# EAGLE design atxmega16d4 (EAGLE 7.3.0)
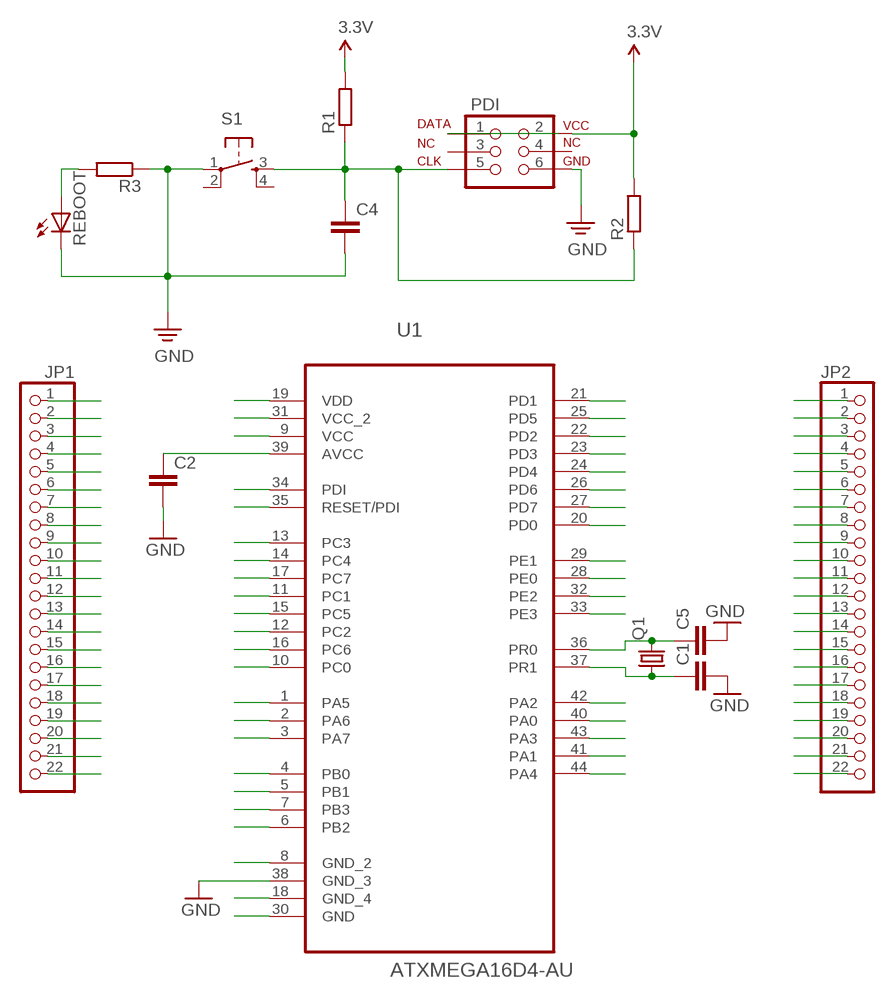
[diagram p0: schematic, sheet 1]

## Parts
C1  C-EU025-025X050  [C025-025X050]
C2  C-EU025-025X050  [C025-025X050]
C4  C-EU025-040X050  [C025-040X050]
C5  C-EU025-025X050  [C025-025X050]
JP1  PINHD-1X22  [1X22]
JP2  PINHD-1X22  [1X22]
PDI  XMEGA_PDI_PRGNS  [2X3-NS]
Q1  CRYSTALHC49U-V  [HC49U-V]
R1  R-EU_0309/10  [0309/10]
R2  R-EU_0207/10  [0207/10]
R3  R-EU_0207/10  [0207/10]
REBOOT  LED3MM  [LED3MM]
S1  TAC_SWITCHPTH  [TACTILE-PTH]
U1  ATXMEGA16D4-AU  [QFP80P1200X1200X120-44N]

## Nets
3.3V: C2.1 JP1.9 JP1.19 JP2.9 JP2.17 PDI.2 R1.2 R2.2 U1.9(VCC) U1.19(VDD) U1.31(VCC_2) U1.39(AVCC)
GND: C1.2 C2.2 C4.2 C5.2 JP1.8 JP1.18 JP2.8 JP2.16 PDI.6 R3.1 REBOOT.K(C) S1.1 U1.8(GND_2) U1.18(GND_4) U1.30(GND) U1.38(GND_3)
N$32: R3.2 REBOOT.A
PA0: JP2.18 U1.40(PA0)
PA1: JP2.19 U1.41(PA1)
PA2: JP2.20 U1.42(PA2)
PA3: JP2.21 U1.43(PA3)
PA4: JP2.22 U1.44(PA4)
PA5: JP1.1 U1.1(PA5)
PA6: JP1.2 U1.2(PA6)
PA7: JP1.3 U1.3(PA7)
PB0: JP1.4 U1.4(PB0)
PB1: JP1.5 U1.5(PB1)
PB2: JP1.6 U1.6(PB2)
PB3: JP1.7 U1.7(PB3)
PC0: JP1.10 U1.10(PC0)
PC1: JP1.11 U1.11(PC1)
PC2: JP1.12 U1.12(PC2)
PC3: JP1.13 U1.13(PC3)
PC4: JP1.14 U1.14(PC4)
PC5: JP1.15 U1.15(PC5)
PC6: JP1.16 U1.16(PC6)
PC7: JP1.17 U1.17(PC7)
PD0: JP1.20 U1.20(PD0)
PD1: JP1.21 U1.21(PD1)
PD2: JP1.22 U1.22(PD2)
PD3: JP2.1 U1.23(PD3)
PD4: JP2.2 U1.24(PD4)
PD5: JP2.3 U1.25(PD5)
PD6: JP2.4 U1.26(PD6)
PD7: JP2.5 U1.27(PD7)
PDI: JP2.12 PDI.1 U1.34(PDI)
PE0: JP2.6 U1.28(PE0)
PE1: JP2.7 U1.29(PE1)
PE2: JP2.10 U1.32(PE2)
PE3: JP2.11 U1.33(PE3)
PR0: C5.1 JP2.14 Q1.2 U1.36(PR0)
PR1: C1.1 JP2.15 Q1.1 U1.37(PR1)
RESET: C4.1 JP2.13 PDI.5 R1.1 R2.1 S1.3 U1.35(RESET/PDI)
Unconnected: PDI.3 PDI.4 S1.2 S1.4

## Library data of the parts
C1 C2 C4 C5 = rcl:C-EU: CAPACITOR, European symbol
JP1 JP2 = pinhead:PINHD-1X22: PIN HEADER
PDI = BattleDroids:XMEGA_PDI_PRG: AVR ISP 6 Pin This is the reduced ISP connector for AVR programming. Common on Arduino. This footprint will take up less PCB space and can be used with a 10-pin to 6-pin adapter such as SKU: BOB-08508
Q1 = crystal:CRYSTAL: CRYSTAL; OC_FARNELL: 1666969; OC_NEWARK: unknown
R1-R3 = rcl:R-EU_: RESISTOR, European symbol
REBOOT = led:LED: LED OSRAM: - CHIPLED LG R971, LG N971, LY N971, LG Q971, LY Q971, LO R971, LY R971 LH N974, LH R974 LS Q976, LO Q976, LY Q976 LO Q996 - Hyper CHIPLED LW Q18S LB Q993, LB Q99A, LB R99A - SideLED LS A670, LO A670, LY A670, LG A670, LP A670 LB A673, LV A673, LT A673, LW A673 LH A674 LY A675 LS A676, LA A676, LO A676, LY A676, LW A676 LS A679, LY A679, LG A679 - Hyper Micro SIDELED® LS Y876, LA Y876, LO Y876, LY Y876 LT Y87S - SmartLED LW L88C, LW L88S LB L89C, LB L89S, LG L890 LS L89K, LO L89K, LY L89K LS L896, LA L896, LO L896, LY L896 - TOPLED LS T670, LO T670, LY T670, LG T670, LP T670 LSG T670, LSP T670, LSY T670, LOP T670, LYG T670 LG T671, LOG T671, LSG T671 LB T673, LV T673, LT T673, LW T673 LH T674 LS T676, LA T676, LO T676, LY T676, LB T676, LH T676, LSB T676, LW T676 LB T67C, LV T67C, LT T67C, LS T67K, LO T67K, LY T67K, LW E67C LS E67B, LA E67B, LO E67B, LY E67B, LB E67C, LV E67C, LT E67C LW T67C LS T679, LY T679, LG T679 LS T770, LO T770, LY T770, LG T770, LP T770 LB T773, LV T773, LT T773, LW T773 LH T774 LS E675, LA E675, LY E675, LS T675 LS T776, LA T776, LO T776, LY T776, LB T776 LHGB T686 LT T68C, LB T68C - Hyper Mini TOPLED® LB M676 - Mini TOPLED Santana® LG M470 LS M47K, LO M47K, LY M47K Source: http://www.osram.convergy.de LUXEON: - LUMILED® LXK2-PW12-R00, LXK2-PW12-S00, LXK2-PW14-U00, LXK2-PW14-V00 LXK2-PM12-R00, LXK2-PM12-S00, LXK2-PM14-U00 LXK2-PE12-Q00, LXK2-PE12-R00, LXK2-PE12-S00, LXK2-PE14-T00, LXK2-PE14-U00 LXK2-PB12-K00, LXK2-PB12-L00, LXK2-PB12-M00, LXK2-PB14-N00, LXK2-PB14-P00, LXK2-PB14-Q00 LXK2-PR12-L00, LXK2-PR12-M00, LXK2-PR14-Q00, LXK2-PR14-R00 LXK2-PD12-Q00, LXK2-PD12-R00, LXK2-PD12-S00 LXK2-PH12-R00, LXK2-PH12-S00 LXK2-PL12-P00, LXK2-PL12-Q00, LXK2-PL12-R00 Source: www.luxeon.com KINGBRIGHT: KA-3528ASYC Source: www.kingbright.com
S1 = SparkFun:TAC_SWITCH: Momentary Switch Button commonly used for reset or general input. Spark Fun Electronics SKU : COM-00097
U1 = atxmega16d4au:ATXMEGA16D4-AU: 8/16-bit Atmel XMEGA D4 Microcontroller; MPN: ATXMEGA16D4-AU; OC_FARNELL: 1748553; OC_NEWARK: 68T3906; PACKAGE: TQFP-44; SUPPLIER: ATMEL

## Board
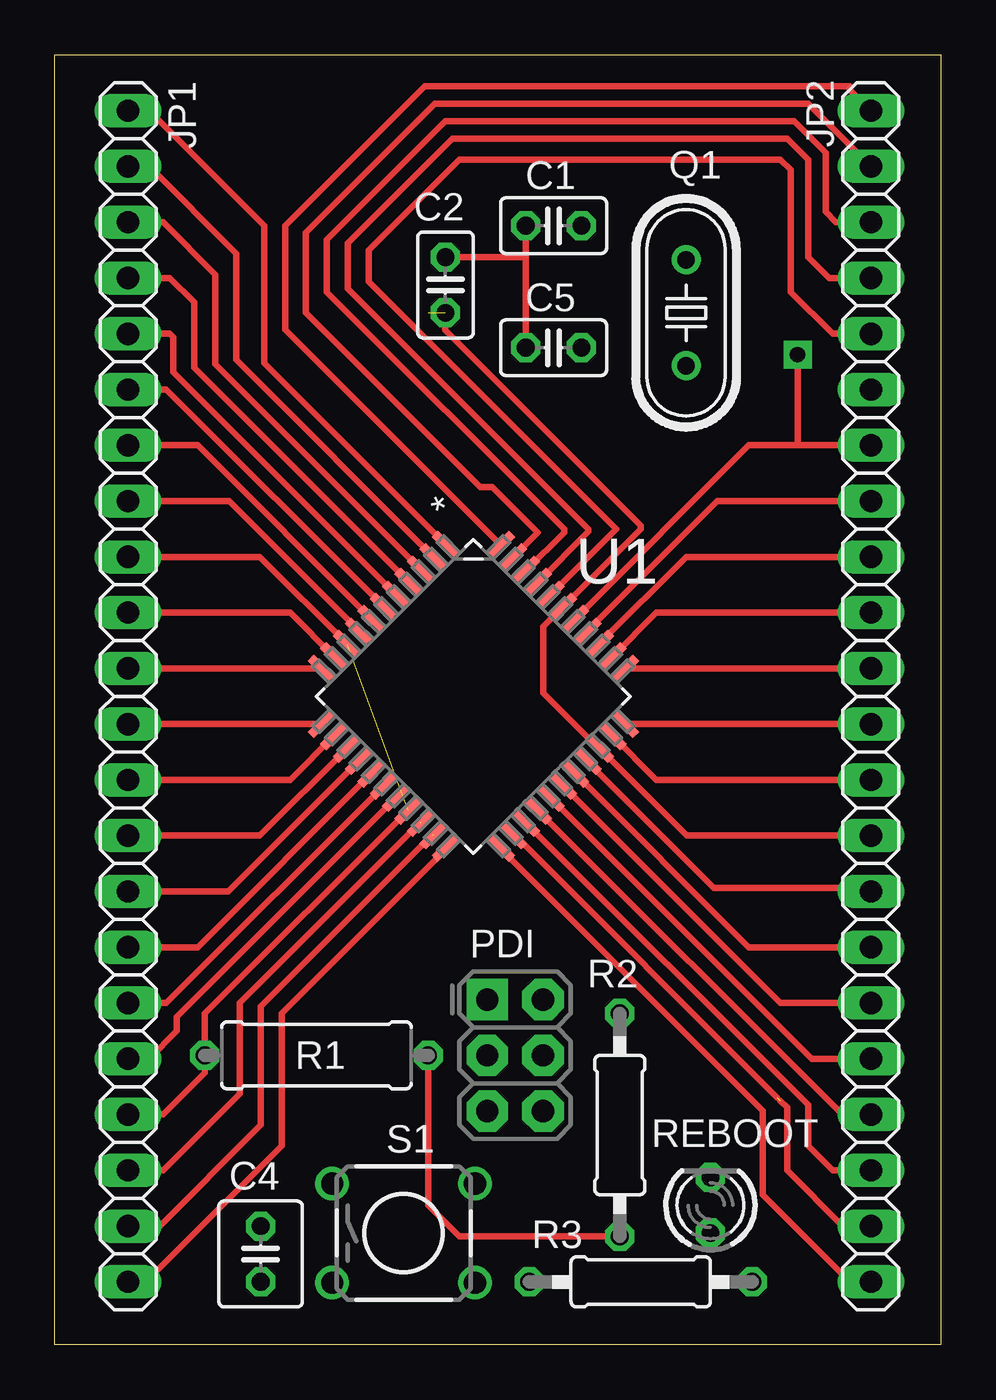
[diagram p1: board, top side]
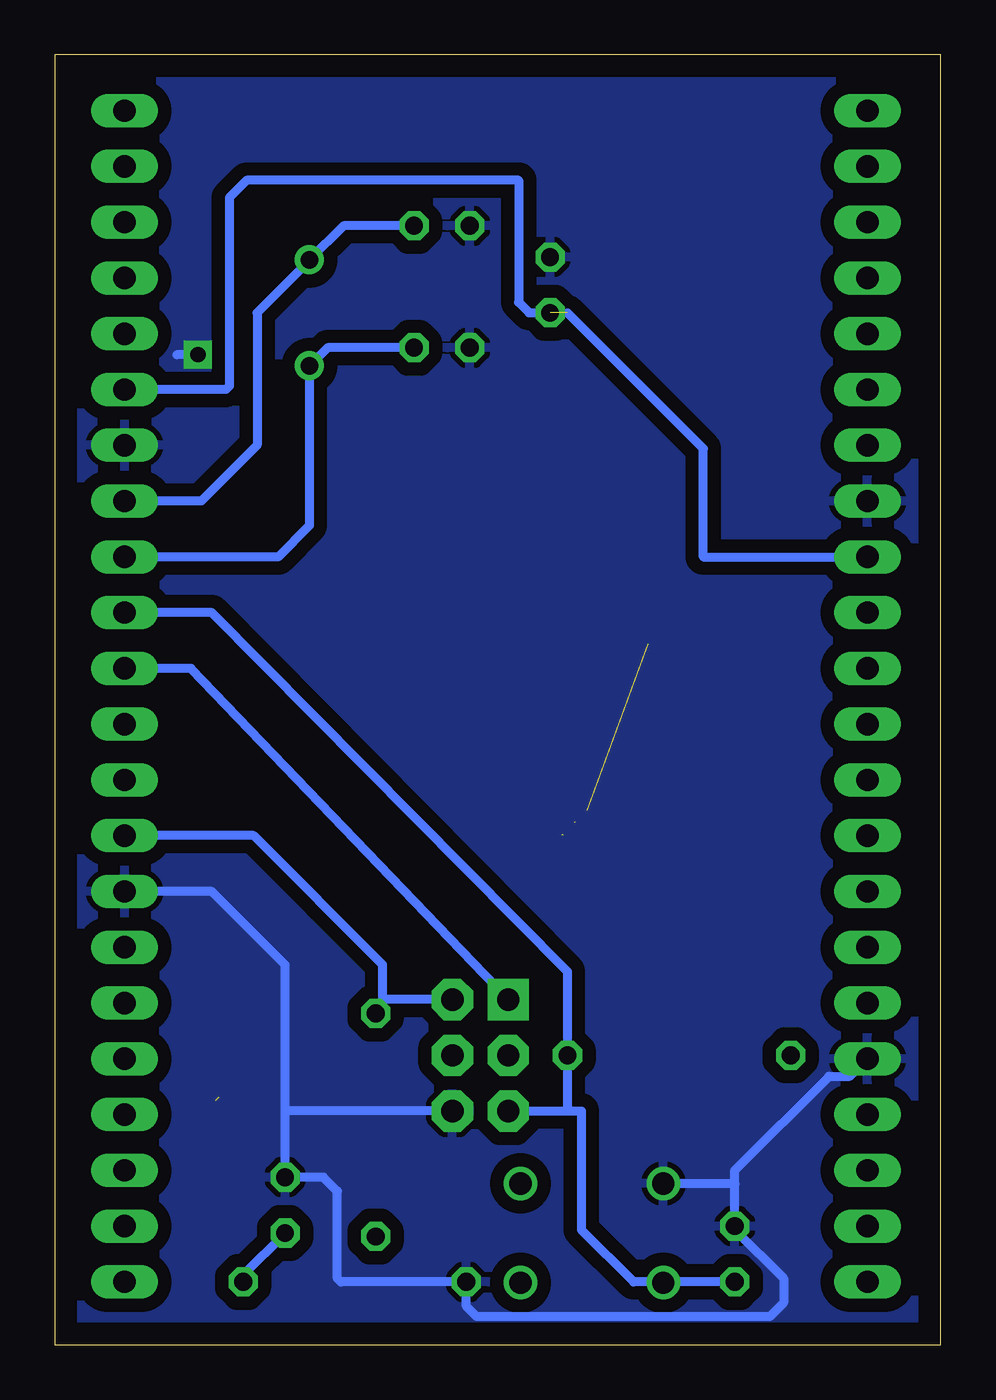
[diagram p2: board, bottom side, seen from below]

Size 40.32 x 58.74 mm. Coordinates in mm from the lower left corner, seen from the top.
Outline: 0,58.74 40.32,58.74 40.32,0 0,0 0,58.74
Copper layers (1*16): Top 0.035mm / dielectric 1.5mm / Bottom 0.035mm
Design rules "default": minimum track width 10mil, minimum drill 24mil, track to track 8mil, track to pad 8mil, pad to pad 8mil, via to via 8mil, smd to smd 8mil, copper to edge 40mil, drill to drill 8mil, minimum pad ring 10mil, minimum via ring 8mil, stop-mask expansion 4mil, vias tented up to drill 0mil, thermal gap 10mil

### Footprints (pad centres in the part's own frame; a part is rotated, then mirrored left to right if it is on the bottom)
C025-025X050 = drill 0.813 octagon: 1 -1.27,0; 2 1.27,0
C025-040X050 = drill 0.813 octagon: 1 -1.27,0; 2 1.27,0
1X22 = drill 1.016 long: 1 -26.67,0; 2 -24.13,0; 3 -21.59,0; 4 -19.05,0; 5 -16.51,0; 6 -13.97,0; 7 -11.43,0; 8 -8.89,0; 9 -6.35,0; 10 -3.81,0; 11 -1.27,0; 12 1.27,0; 13 3.81,0; 14 6.35,0; 15 8.89,0; 16 11.43,0; 17 13.97,0; 18 16.51,0; 19 19.05,0; 20 21.59,0; 21 24.13,0; 22 26.67,0
2X3-NS = drill 1.016 pad 1.88 square: 1 -2.54,-1.27 | drill 1.016 pad 1.88 octagon: 2 -2.54,1.27; 3 0,-1.27; 4 0,1.27; 5 2.54,-1.27; 6 2.54,1.27
HC49U-V = drill 0.813: 1 -2.413,0; 2 2.413,0
0309/10 = drill 0.813 octagon: 1 -5.08,0; 2 5.08,0
0207/10 = drill 0.813 octagon: 1 -5.08,0; 2 5.08,0
LED3MM = drill 0.813 octagon: A -1.27,0; K 1.27,0
TACTILE-PTH = drill 1.016: 1 -3.251,2.261; 2 3.251,2.261; 3 -3.251,-2.261; 4 3.251,-2.261
QFP80P1200X1200X120-44N = smd 1.473 x 0.406: 1 -5.74,3.988; 2 -5.74,3.2; 3 -5.74,2.388; 4 -5.74,1.6; 5 -5.74,0.787; 6 -5.74,0; 7 -5.74,-0.787; 8 -5.74,-1.6; 9 -5.74,-2.388; 10 -5.74,-3.2; 11 -5.74,-3.988; 23 5.74,-3.988; 24 5.74,-3.2; 25 5.74,-2.388; 26 5.74,-1.6; 27 5.74,-0.787; 28 5.74,0; 29 5.74,0.787; 30 5.74,1.6; 31 5.74,2.388; 32 5.74,3.2; 33 5.74,3.988 | smd 0.406 x 1.473: 12 -3.988,-5.74; 13 -3.2,-5.74; 14 -2.388,-5.74; 15 -1.6,-5.74; 16 -0.787,-5.74; 17 0,-5.74; 18 0.787,-5.74; 19 1.6,-5.74; 20 2.388,-5.74; 21 3.2,-5.74; 22 3.988,-5.74; 34 3.988,5.74; 35 3.2,5.74; 36 2.388,5.74; 37 1.6,5.74; 38 0.787,5.74; 39 0,5.74; 40 -0.787,5.74; 41 -1.6,5.74; 42 -2.388,5.74; 43 -3.2,5.74; 44 -3.988,5.74

### Placement (x,y rotation side)
C1  22.7,50.96 180 top
C2  17.78,48.26 90 top
C4  9.37,4.13 90 top
C5  22.7,45.4 180 top
JP1  3.33,29.53 270 top
JP2  37.15,29.53 90 top
PDI  20.95,13.18 270 top
Q1  28.73,46.99 270 top
R1  11.91,13.18 180 top
R2  25.72,10 90 top
R3  26.67,2.86 0 top
REBOOT  29.84,6.35 90 top
S1  15.88,5.08 0 top
U1  19.05,29.53 315 top

### Tracks (layer width: path | path; a pad name or v marks a point on that pad's centre or on a via)
3.3V  (2 unrouted)
  Top 0.305: JP1.9 9.32,35.88 U1.9 | JP2.9 28.78,23.18 U1.31 24.75,27.16 22.23,29.69 22.23,32.7 U1.39 26.67,37.15 26.67,37.31 17.78,46.2 C2.1 | JP1.19 4.92,10.48 6.83,12.38 R1.2 6.83,15.08 16.08,24.34 U1.19
  Bottom 0.406: JP2.9 31.27,23.18 25.4,17.3 25.4,15.72 | R2.2 25.4,15.72 | JP2.17 32.54,43.5 32.38,43.66 32.38,52.23 31.59,53.02 19.21,53.02 19.21,47.47 18.73,46.99 C2.1 | JP1.9 10.79,35.88 10.79,40.8 16.99,46.99 | PDI.2 25.4,15.72
GND  (via drill 0.7 pad 1.27)
  Top 0.305: U1.38 31.59,40.96 33.81,40.96 | JP1.18 4.29,13.02 5.56,14.29 5.56,14.92 U1.18 | C2.2 21.43,49.53 | 21.43,49.53 C1.2 | C5.2 21.43,49.53 | U1.8 13.86,32.5 7.94,38.42 JP1.8 | U1.30 24.24,26.56 30,20.8 36.99,20.8 | 33.81,40.96 v33.81,45.09 | JP2.16 33.81,40.96
  Top 0.406: U1.38 | 36.99,20.8 JP2.8
  Bottom 0.406: PDI.6 29.84,10.64 | 29.84,10.64 REBOOT.K 28.1,7.62 27.46,6.99 27.46,3.02 27.3,2.86 R3.1 21.59,1.75 21.11,1.27 7.78,1.27 7.14,1.91 7.14,3.02 9.37,5.24 C4.2 9.37,7.3 | 29.84,10.64 29.84,17.3 33.18,20.64 JP2.8 | 9.37,7.3 9.37,7.94 5.08,12.22 4.13,12.22 JP1.18 | S1.1 9.4,7.34 9.37,7.3 | v33.81,45.09 34.77,45.09
  pour Bottom (isolate 0.61): 0.32,58.42 40.01,58.42 40.01,0.32 0.32,0.32
N$32
  Bottom 0.406: R3.2 31.75,3.18 REBOOT.A
PA0
  Top 0.305: U1.40 25.56,37.15 14.29,48.42 14.29,49.85 18.41,53.98 33.02,53.98 33.5,53.5 33.5,47.94 35.4,46.04 JP2.18
  Top 0.406: U1.40
PA1
  Top 0.305: JP2.19 35.24,48.58 34.29,49.53 34.29,53.98 33.34,54.93 18.1,54.93 13.34,50.17 13.34,48.1 24.29,37.15 24.29,37.03 U1.41
PA2
  Top 0.305: U1.42 21.46,35.28 23.18,36.99 23.18,37.15 12.38,47.94 12.38,50.32 17.78,55.72 33.66,55.72 35.08,54.29 35.08,51.59 35.56,51.12 JP2.20
PA3
  Top 0.305: U1.43 21.98,36.99 19.92,39.05 19.37,39.05 11.43,46.99 11.43,50.64 17.3,56.52 34.29,56.52 JP2.21
PA4
  Top 0.305: U1.44 10.48,46.22 10.48,50.96 16.83,57.31 36.2,57.31 36.2,57.15 JP2.22
PA5
  Top 0.305: JP1.1 4.29,56.2 9.53,50.96 9.53,44.69 U1.1
PA6
  Top 0.305: JP1.2 4.29,53.66 8.26,49.69 8.26,44.85 U1.2
PA7
  Top 0.305: JP1.3 4.92,51.12 7.3,48.74 7.3,44.65 U1.3
PB0
  Top 0.305: JP1.4 5.24,48.58 6.35,47.47 6.35,44.49 U1.4
PB1
  Top 0.305: U1.5 5.4,44.29 5.4,45.88 5.24,46.04 JP1.5
PB2
  Top 0.305: U1.6 5.08,43.5 JP1.6
PB3
  Top 0.305: JP1.7 6.51,40.96 U1.7
PC0
  Top 0.305: JP1.10 10.71,33.34 U1.10
PC1
  Top 0.305: JP1.11 12.14,30.8
  Top 0.406: 12.14,30.8 U1.11
PC2
  Top 0.305: JP1.12 12.14,28.26
  Top 0.406: 12.14,28.26 U1.12
PC3
  Top 0.305: JP1.13 10.71,25.72 U1.13
PC4
  Top 0.305: JP1.14 9.32,23.18 U1.14
PC5
  Top 0.305: U1.15 7.9,20.64 JP1.15
PC6
  Top 0.305: U1.16 6.51,18.1 JP1.16
PC7
  Top 0.305: U1.17 5.08,15.56 JP1.17
PD0  (1 unrouted)
  Top 0.305: 16.64,23.78 8.41,15.56 8.41,11.43 4.92,7.94 JP1.20
PD1  (1 unrouted)
  Top 0.305: 17.17,23.21 9.37,15.4 9.37,10 4.6,5.24 3.49,5.24 JP1.21
PD2
  Top 0.305: U1.22 17.81,22.57 10.32,15.08 10.32,9.05 4.13,2.86 JP1.22
PD3
  Top 0.305: JP2.1 36.2,2.86 32.23,6.83 32.23,10.64 20.29,22.57 U1.23
PD4  (1 unrouted)
  Top 0.305: JP2.2 35.88,5.4 33.34,7.94 33.34,10.8 33.02,11.11 | U1.24 20.93,23.21 32.86,11.27
PD5
  Top 0.305: JP2.3 35.4,7.94 34.29,9.05 34.29,10.91 U1.25
PD6
  Top 0.305: JP2.4 35.84,10.48 U1.26
PD7
  Top 0.305: JP2.5 34.45,13.02 U1.27
PDI
  Top 0.305: JP2.12 25.96,30.8
  Top 0.406: 25.96,30.8 U1.34
  Bottom 0.406: PDI.1 34.13,30.8 JP2.12
PE0
  Top 0.305: JP2.6 33.02,15.56 U1.28
PE1
  Top 0.305: JP2.7 31.59,18.1 U1.29
PE2
  Top 0.305: JP2.10 27.39,25.72 U1.32
PE3
  Top 0.305: JP2.11 25.96,28.26
  Top 0.406: 25.96,28.26 U1.33
PR0
  Top 0.305: U1.36 24.8,31.94 28.73,35.88 JP2.14
  Bottom 0.406: JP2.14 30.16,35.88 28.73,37.31 Q1.2 27.91,45.4 C5.1
PR1
  Top 0.305: U1.37 24.24,32.5 30.16,38.42 JP2.15
  Bottom 0.406: JP2.15 33.66,38.42 31.11,40.96 31.11,46.99 28.73,49.37 Q1.1 27.18,50.96 C1.1
RESET
  Top 0.305: JP2.13 27.39,33.34 U1.35 | R1.1 16.99,6.35 18.41,4.92 R2.1
  Bottom 0.406: JP2.13 33.18,33.34 16.99,16.99 R1.1 16.99,10.8 16.83,10.64 | C4.1 12.59,2.86 S1.3 12.66,2.86 13.97,2.86 16.35,5.24 16.35,10.64 16.83,10.64 | PDI.5 16.83,10.64